# EAGLE design L293D_Motor_Driver (EAGLE 6.5.0)
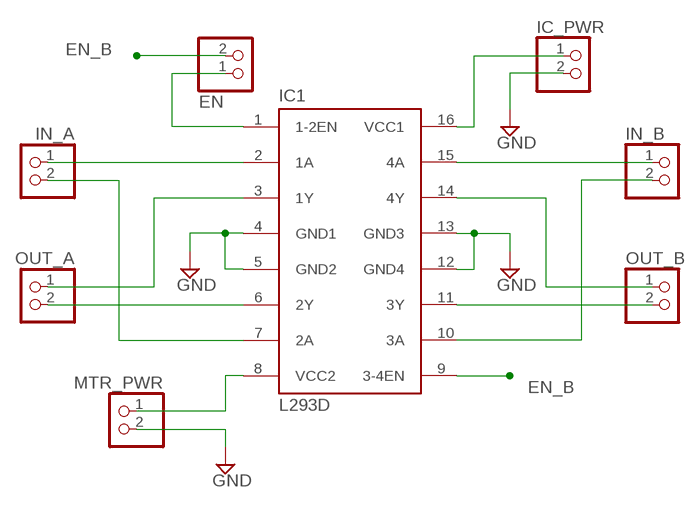
[diagram p0: schematic, sheet 1]

## Parts
EN  PINHD-1X2  [1X02]
IC1  L293D  [DIL16]
IC_PWR  PINHD-1X2  [1X02]
IN_A  PINHD-1X2  [1X02]
IN_B  PINHD-1X2  [1X02]
MTR_PWR  PINHD-1X2  [1X02]
OUT_A  PINHD-1X2  [1X02]
OUT_B  PINHD-1X2  [1X02]

## Nets
1A: IC1.2(1A) IN_A.1
1Y: IC1.3(1Y) OUT_A.1
2A: IC1.7(2A) IN_A.2
2Y: IC1.6(2Y) OUT_A.2
3A: IC1.10(3A) IN_B.2
3Y: IC1.11(3Y) OUT_B.2
4A: IC1.15(4A) IN_B.1
4Y: IC1.14(4Y) OUT_B.1
EN_A: EN.1 IC1.1(1-2EN)
EN_B: EN.2 IC1.9(3-4EN)
GND: IC1.4(GND1) IC1.5(GND2) IC1.12(GND4) IC1.13(GND3) IC_PWR.2 MTR_PWR.2
N$9: IC1.16(VCC1) IC_PWR.1
N$11: IC1.8(VCC2) MTR_PWR.1

## Library data of the parts
EN IC_PWR IN_A IN_B MTR_PWR OUT_A OUT_B = pinhead:PINHD-1X2: PIN HEADER
IC1 = st-microelectronics:L293D: PUSH-PULL 4 CHANNEL DRIVER; MPN: L293D; OC_FARNELL: 9589619; OC_NEWARK: 56P8249

## Board
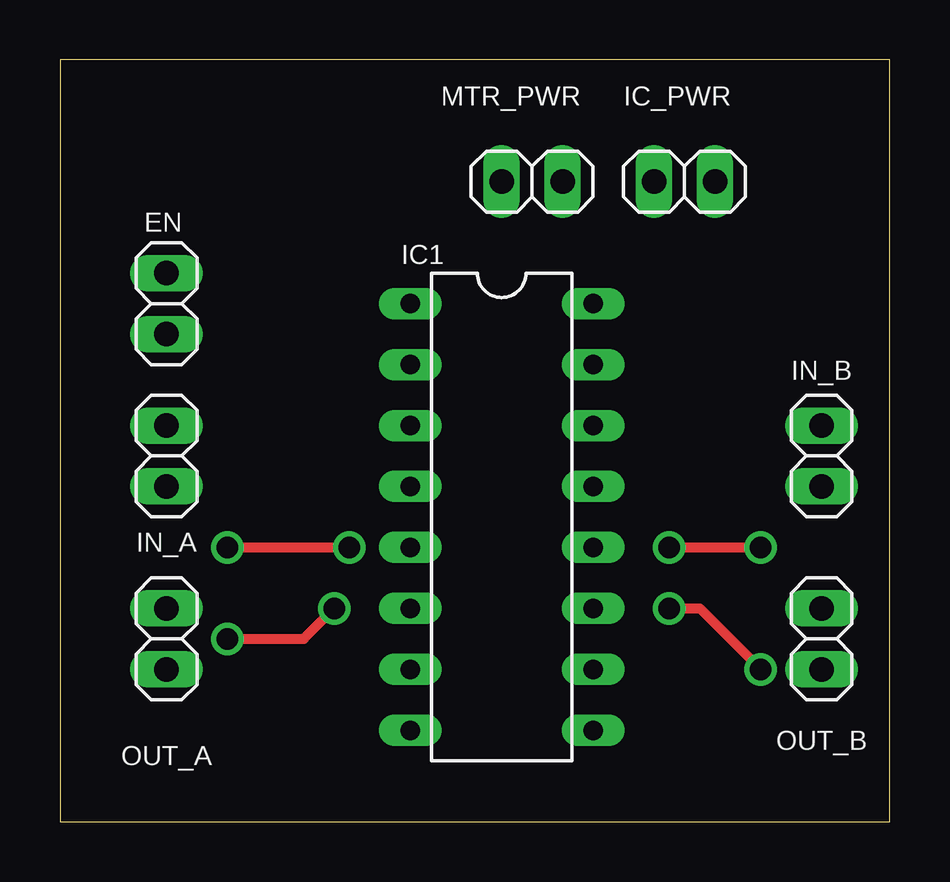
[diagram p1: board, top side]
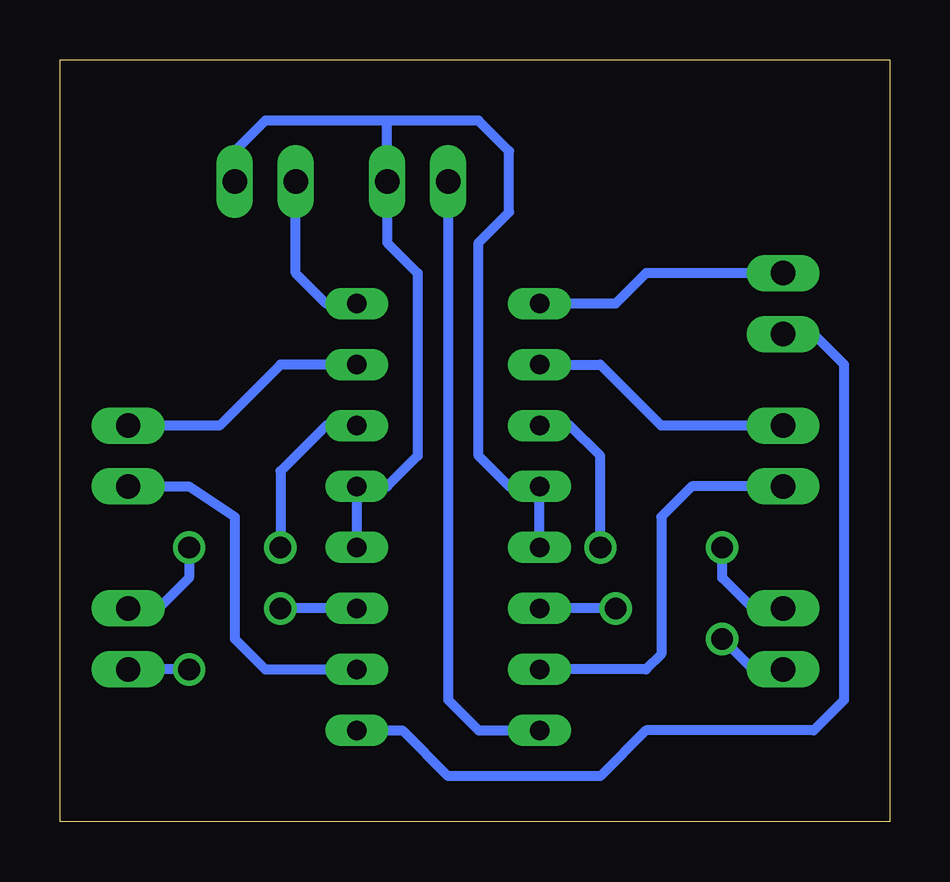
[diagram p2: board, bottom side, seen from below]

Size 34.59 x 31.74 mm. Coordinates in mm from the lower left corner, seen from the top.
Outline: 0,0 34.59,0 34.59,31.74 0,31.74 0,0
Copper layers (1*16): Top 0.035mm / dielectric 1.5mm / Bottom 0.035mm
Design rules "default": minimum track width 10mil, minimum drill 24mil, track to track 8mil, track to pad 8mil, pad to pad 8mil, via to via 8mil, smd to smd 8mil, copper to edge 40mil, drill to drill 8mil, minimum pad ring 10mil, minimum via ring 8mil, stop-mask expansion 4mil, vias tented up to drill 0mil, thermal gap 10mil

### Footprints (pad centres in the part's own frame; a part is rotated, then mirrored left to right if it is on the bottom)
1X02 = drill 1.016 long: 1 -1.27,0; 2 1.27,0
DIL16 = drill 0.813 long: 1 -8.89,-3.81; 2 -6.35,-3.81; 3 -3.81,-3.81; 4 -1.27,-3.81; 5 1.27,-3.81; 6 3.81,-3.81; 7 6.35,-3.81; 8 8.89,-3.81; 9 8.89,3.81; 10 6.35,3.81; 11 3.81,3.81; 12 1.27,3.81; 13 -1.27,3.81; 14 -3.81,3.81; 15 -6.35,3.81; 16 -8.89,3.81

### Placement (x,y rotation side)
EN  4.45,21.59 270 top
IC1  18.41,12.7 270 top
IC_PWR  26.04,26.67 0 top
IN_A  4.45,15.24 270 top
IN_B  31.75,15.24 270 top
MTR_PWR  19.68,26.67 0 top
OUT_A  4.45,7.62 270 top
OUT_B  31.75,7.62 270 top

### Tracks (layer width: path | path; a pad name or v marks a point on that pad's centre or on a via)
1A
  Bottom 0.406: IC1.2 12.06,19.05 9.53,16.51 IN_A.1
1Y  (via drill 0.9)
  Top 0.406: v6.99,11.43 v12.06,11.43
  Bottom 0.406: OUT_A.1 5.71,8.89 6.99,10.16 v6.99,11.43 | v12.06,11.43 12.06,15.24 13.34,16.51 IC1.3
2A
  Bottom 0.406: IN_A.2 8.26,13.97 9.53,12.7 9.53,6.99 10.16,6.35 IC1.7
2Y  (via drill 0.9)
  Top 0.406: v6.99,7.62 10.16,7.62 v11.43,8.89
  Bottom 0.406: v11.43,8.89 IC1.6 | OUT_A.2 5.71,6.35 v6.99,7.62
3A
  Bottom 0.406: IN_B.2 29.21,13.97 27.3,12.7 27.3,7.62 26.04,6.35 IC1.10
3Y  (via drill 0.9)
  Top 0.406: v25.4,8.89 26.67,8.89 v29.21,6.35
  Bottom 0.406: IC1.11 v25.4,8.89 | v29.21,6.35 OUT_B.2
4A
  Bottom 0.406: IC1.15 25.4,19.05 27.94,16.51 IN_B.1
4Y  (via drill 0.9)
  Top 0.406: v25.4,11.43 v29.21,11.43
  Bottom 0.406: IC1.14 23.5,16.51 25.4,14.61 v25.4,11.43 | v29.21,11.43 29.21,10.16 30.48,8.89 OUT_B.1
EN_A
  Bottom 0.406: EN.1 10.16,22.86 11.43,21.59 IC1.1
EN_B
  Bottom 0.406: EN.2 3.17,20.32 1.91,19.05 1.91,5.08 3.17,3.81 10.16,3.81 12.06,1.91 18.41,1.91 20.32,3.81 IC1.9
GND
  Bottom 0.406: IC_PWR.2 27.3,27.94 26.04,29.21 20.95,29.21 | IC1.5 IC1.4 15.88,13.97 17.14,15.24 17.14,24.13 15.88,25.4 15.88,27.94 17.14,29.21 20.95,29.21 | IC1.12 IC1.13 20.95,13.97 19.68,15.24 19.68,22.86 20.95,24.13 MTR_PWR.2 20.95,29.21
N$9
  Bottom 0.406: IC1.16 23.5,21.59 24.77,22.86 IC_PWR.1
N$11
  Bottom 0.406: MTR_PWR.1 18.41,5.08 17.14,3.81 IC1.8